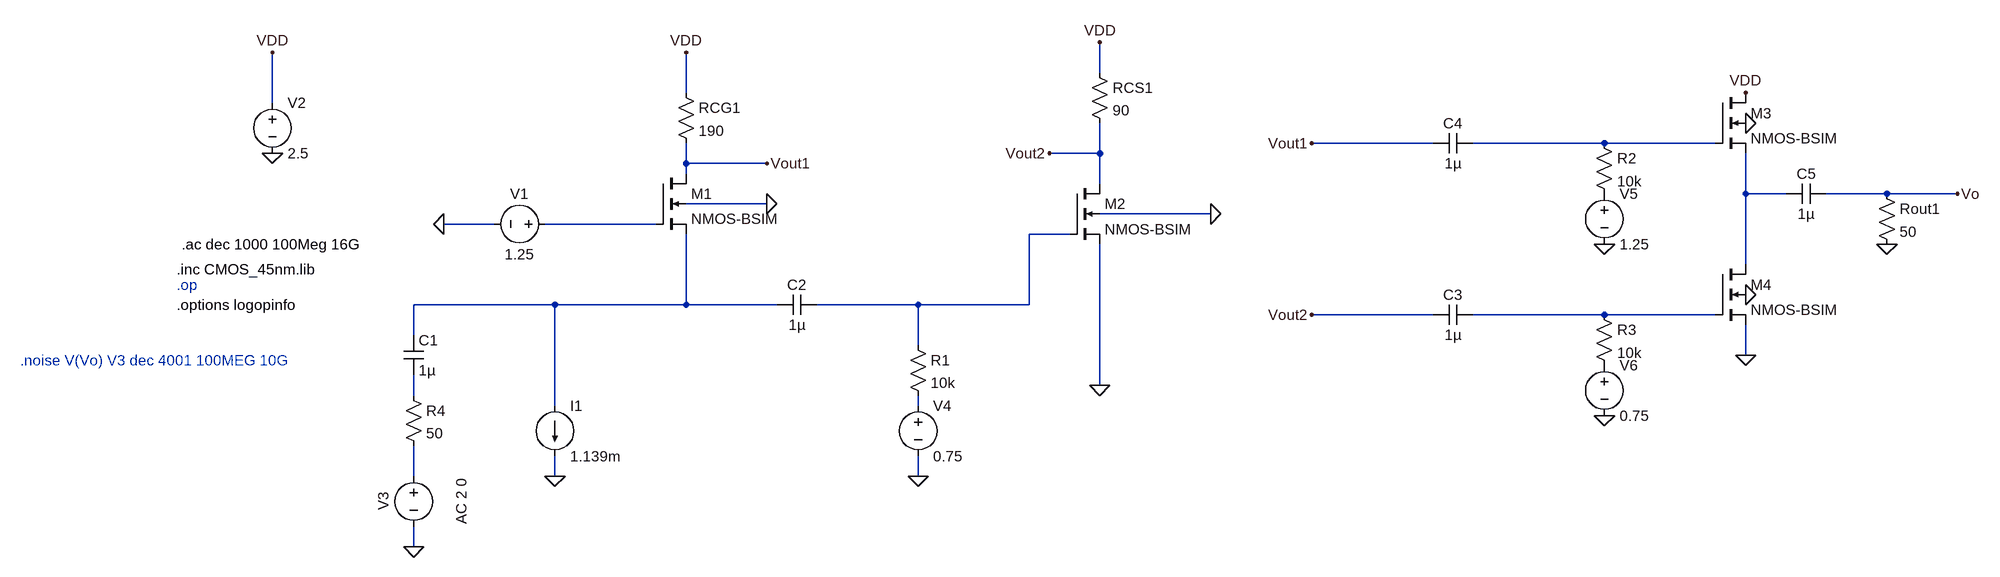
[diagram p0: schematic NMOS_45nm_N275.asc]
NMOS_45nm_N275.asc, the LTspice schematic file:
Version 4.1
SHEET 1 2016 680
WIRE 608 -224 608 -272
WIRE -48 -192 -48 -256
WIRE -704 -176 -704 -256
WIRE 1136 -112 944 -112
WIRE 1408 -112 1200 -112
WIRE 1584 -112 1408 -112
WIRE 608 -96 608 -144
WIRE 608 -96 528 -96
WIRE -48 -80 -48 -112
WIRE 80 -80 -48 -80
WIRE -48 -64 -48 -80
WIRE 608 -48 608 -96
WIRE 1632 -32 1632 -96
WIRE 1696 -32 1632 -32
WIRE 1856 -32 1760 -32
WIRE 1968 -32 1856 -32
WIRE 80 -16 -48 -16
WIRE 784 0 608 0
WIRE -352 16 -432 16
WIRE -96 16 -272 16
WIRE 560 32 496 32
WIRE 1632 80 1632 -32
WIRE -256 144 -480 144
WIRE -48 144 -48 32
WIRE -48 144 -256 144
WIRE 96 144 -48 144
WIRE 320 144 160 144
WIRE 496 144 496 32
WIRE 496 144 320 144
WIRE 1136 160 944 160
WIRE 1408 160 1200 160
WIRE 1584 160 1408 160
WIRE -480 192 -480 144
WIRE 320 208 320 144
WIRE 1632 224 1632 176
WIRE 608 272 608 48
WIRE -480 288 -480 256
WIRE -256 304 -256 144
WIRE 320 304 320 288
WIRE -480 416 -480 368
WIRE -256 416 -256 384
WIRE 320 416 320 384
WIRE -480 528 -480 496
FLAG -432 16 0
FLAG -704 -96 0
FLAG -704 -256 VDD
FLAG -48 -256 VDD
FLAG -256 416 0
FLAG 80 -16 0
FLAG -480 528 0
FLAG 80 -80 Vout1
FLAG 528 -96 Vout2
FLAG 608 272 0
FLAG 608 -272 VDD
FLAG 784 0 0
FLAG 320 416 0
FLAG 1408 48 0
FLAG 1408 320 0
FLAG 1632 224 0
FLAG 1632 -192 VDD
FLAG 944 160 Vout2
FLAG 944 -112 Vout1
FLAG 1632 -144 0
FLAG 1632 128 0
FLAG 1968 -32 Vo
FLAG 1856 48 0
SYMBOL voltage -256 16 R90
WINDOW 0 -32 56 VBottom 2
WINDOW 3 32 56 VTop 2
WINDOW 123 0 0 Left 0
WINDOW 39 0 0 Left 0
SYMATTR InstName V1
SYMATTR Value 1.25
SYMBOL voltage -704 -192 R0
SYMATTR InstName V2
SYMATTR Value 2.5
SYMBOL res -64 -208 R0
SYMATTR InstName RCG1
SYMATTR Value 190
SYMBOL voltage -480 400 R0
WINDOW 0 -32 56 VBottom 2
WINDOW 3 32 56 VTop 2
WINDOW 123 60 56 VTop 2
WINDOW 39 88 56 VTop 2
SYMATTR InstName V3
SYMATTR Value ""
SYMATTR Value2 AC 2 0
SYMBOL nmos4 -96 -64 R0
SYMATTR InstName M1
SYMATTR Value NMOS-BSIM
SYMATTR Value2 l=700n w=355u
SYMBOL current -256 304 R0
WINDOW 123 0 0 Left 0
WINDOW 39 0 0 Left 0
SYMATTR InstName I1
SYMATTR Value 1.139m
SYMBOL cap -496 192 R0
SYMATTR InstName C1
SYMATTR Value 1µ
SYMBOL nmos4 560 -48 R0
SYMATTR InstName M2
SYMATTR Value NMOS-BSIM
SYMATTR Value2 l=700n w=800u
SYMBOL res 592 -240 R0
SYMATTR InstName RCS1
SYMATTR Value 90
SYMBOL cap 160 128 R90
WINDOW 0 0 32 VBottom 2
WINDOW 3 32 32 VTop 2
SYMATTR InstName C2
SYMATTR Value 1µ
SYMBOL voltage 320 288 R0
SYMATTR InstName V4
SYMATTR Value 0.75
SYMBOL res 304 192 R0
SYMATTR InstName R1
SYMATTR Value 10k
SYMBOL cap 1200 144 R90
WINDOW 0 0 32 VBottom 2
WINDOW 3 32 32 VTop 2
SYMATTR InstName C3
SYMATTR Value 1µ
SYMBOL cap 1200 -128 R90
WINDOW 0 0 32 VBottom 2
WINDOW 3 32 32 VTop 2
SYMATTR InstName C4
SYMATTR Value 1µ
SYMBOL res 1392 -128 R0
SYMATTR InstName R2
SYMATTR Value 10k
SYMBOL res 1392 144 R0
SYMATTR InstName R3
SYMATTR Value 10k
SYMBOL voltage 1408 -48 R0
SYMATTR InstName V5
SYMATTR Value 1.25
SYMBOL voltage 1408 224 R0
SYMATTR InstName V6
SYMATTR Value 0.75
SYMBOL nmos4 1584 -192 R0
SYMATTR InstName M3
SYMATTR Value NMOS-BSIM
SYMATTR Value2 l=700n w=355u
SYMBOL nmos4 1584 80 R0
SYMATTR InstName M4
SYMATTR Value NMOS-BSIM
SYMATTR Value2 l=700n w=800u
SYMBOL cap 1760 -48 R90
WINDOW 0 0 32 VBottom 2
WINDOW 3 32 32 VTop 2
SYMATTR InstName C5
SYMATTR Value 1µ
SYMBOL res 1840 -48 R0
SYMATTR InstName Rout1
SYMATTR Value 50
SYMBOL res -496 272 R0
SYMATTR InstName R4
SYMATTR Value 50
TEXT -856 112 Left 2 ;.op
TEXT -856 144 Left 2 !.options logopinfo
TEXT -856 88 Left 2 !.inc CMOS_45nm.lib
TEXT -848 48 Left 2 !.ac dec 1000 100Meg 16G
TEXT -1104 232 Left 2 ;.noise V(Vo) V3 dec 4001 100MEG 10G

The netlist it stands for:
* NMOS_45nm_N275.asc
V1 N003 0 1.25
V2 VDD 0 2.5
RCG1 VDD Vout1 190
V3 N009 0 AC 2 0
M1 Vout1 N003 N005 0 NMOS-BSIM l=700n w=355u
I1 N005 0 1.139m
C1 N005 N007 1µ
M2 Vout2 N004 0 0 NMOS-BSIM l=700n w=800u
RCS1 VDD Vout2 90
C2 N004 N005 1µ
V4 N008 0 0.75
R1 N004 N008 10k
C3 N006 Vout2 1µ
C4 N001 Vout1 1µ
R2 N001 P001 10k
R3 N006 P002 10k
V5 P001 0 1.25
V6 P002 0 0.75
M3 VDD N001 N002 0 NMOS-BSIM l=700n w=355u
M4 N002 N006 0 0 NMOS-BSIM l=700n w=800u
C5 Vo N002 1µ
Rout1 Vo 0 50
R4 N007 N009 50
.model NMOS NMOS
.model PMOS PMOS
.lib standard.mos
* .op
.options logopinfo
.inc CMOS_45nm.lib
.ac dec 1000 100Meg 16G
* .noise V(Vo) V3 dec 4001 100MEG 10G
.backanno
.end